# EAGLE design EDMCB (EAGLE 6.6.0)
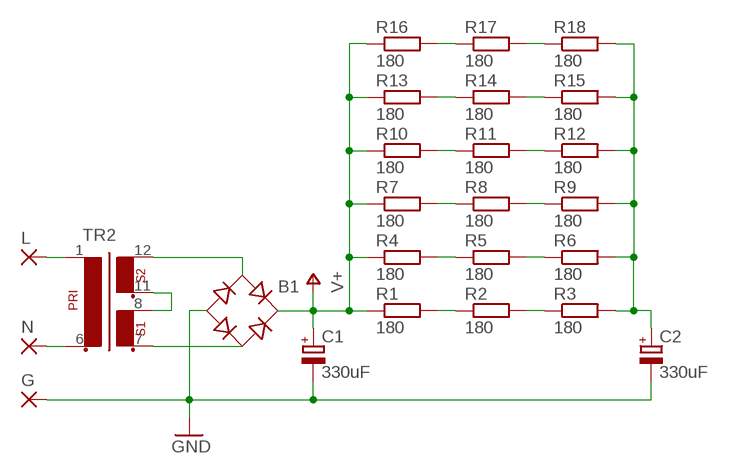
[diagram p0: schematic, sheet 1]

## Parts
B1  RECTIFIER-FB32  [FB32]
C1  330uF  CPOL-EUSANYO_H  [SANYO-OSCON_H]
C2  330uF  CPOL-EUSANYO_H  [SANYO-OSCON_H]
G  WIREPAD4,16O1,6  [4,16O1,6]
L  WIREPAD4,16O1,6  [4,16O1,6]
N  WIREPAD4,16O1,6  [4,16O1,6]
R1  180  R-EU_VTA52  [VTA52]
R2  180  R-EU_VTA52  [VTA52]
R3  180  R-EU_VTA52  [VTA52]
R4  180  R-EU_VTA52  [VTA52]
R5  180  R-EU_VTA52  [VTA52]
R6  180  R-EU_VTA52  [VTA52]
R7  180  R-EU_VTA52  [VTA52]
R8  180  R-EU_VTA52  [VTA52]
R9  180  R-EU_VTA52  [VTA52]
R10  180  R-EU_VTA52  [VTA52]
R11  180  R-EU_VTA52  [VTA52]
R12  180  R-EU_VTA52  [VTA52]
R13  180  R-EU_VTA52  [VTA52]
R14  180  R-EU_VTA52  [VTA52]
R15  180  R-EU_VTA52  [VTA52]
R16  180  R-EU_VTA52  [VTA52]
R17  180  R-EU_VTA52  [VTA52]
R18  180  R-EU_VTA52  [VTA52]
TR2  EI48-2  [EI48-2]

## Nets
GND: B1.- C1.- C2.- G.1(P)
N$1: C2.+ R3.2 R6.2 R9.2 R12.2 R15.2 R18.2
N$2: R1.2 R2.1
N$3: R2.2 R3.1
N$4: N.1(P) TR2.6
N$5: L.1(P) TR2.1
N$6: B1.AC1 TR2.12
N$7: R4.2 R5.1
N$8: R5.2 R6.1
N$9: TR2.8 TR2.11
N$10: B1.AC2 TR2.7
N$11: R7.2 R8.1
N$12: R8.2 R9.1
N$13: R10.2 R11.1
N$14: R11.2 R12.1
N$15: R13.2 R14.1
N$16: R14.2 R15.1
N$17: R16.2 R17.1
N$18: R17.2 R18.1
V+: B1.+ C1.+ R1.1 R4.1 R7.1 R10.1 R13.1 R16.1

## Library data of the parts
B1 = rectifier:RECTIFIER-: Rectifier
C1 C2 = rcl:CPOL-EU: POLARIZED CAPACITOR, European symbol
G L N = wirepad:WIREPAD: Wire PAD connect wire on PCB
R1-R18 = rcl:R-EU_: RESISTOR, European symbol
TR2 = trafo:EI48-2: TRANSFORMER 1 primary winding, 2 secondary windings ERA

## Board
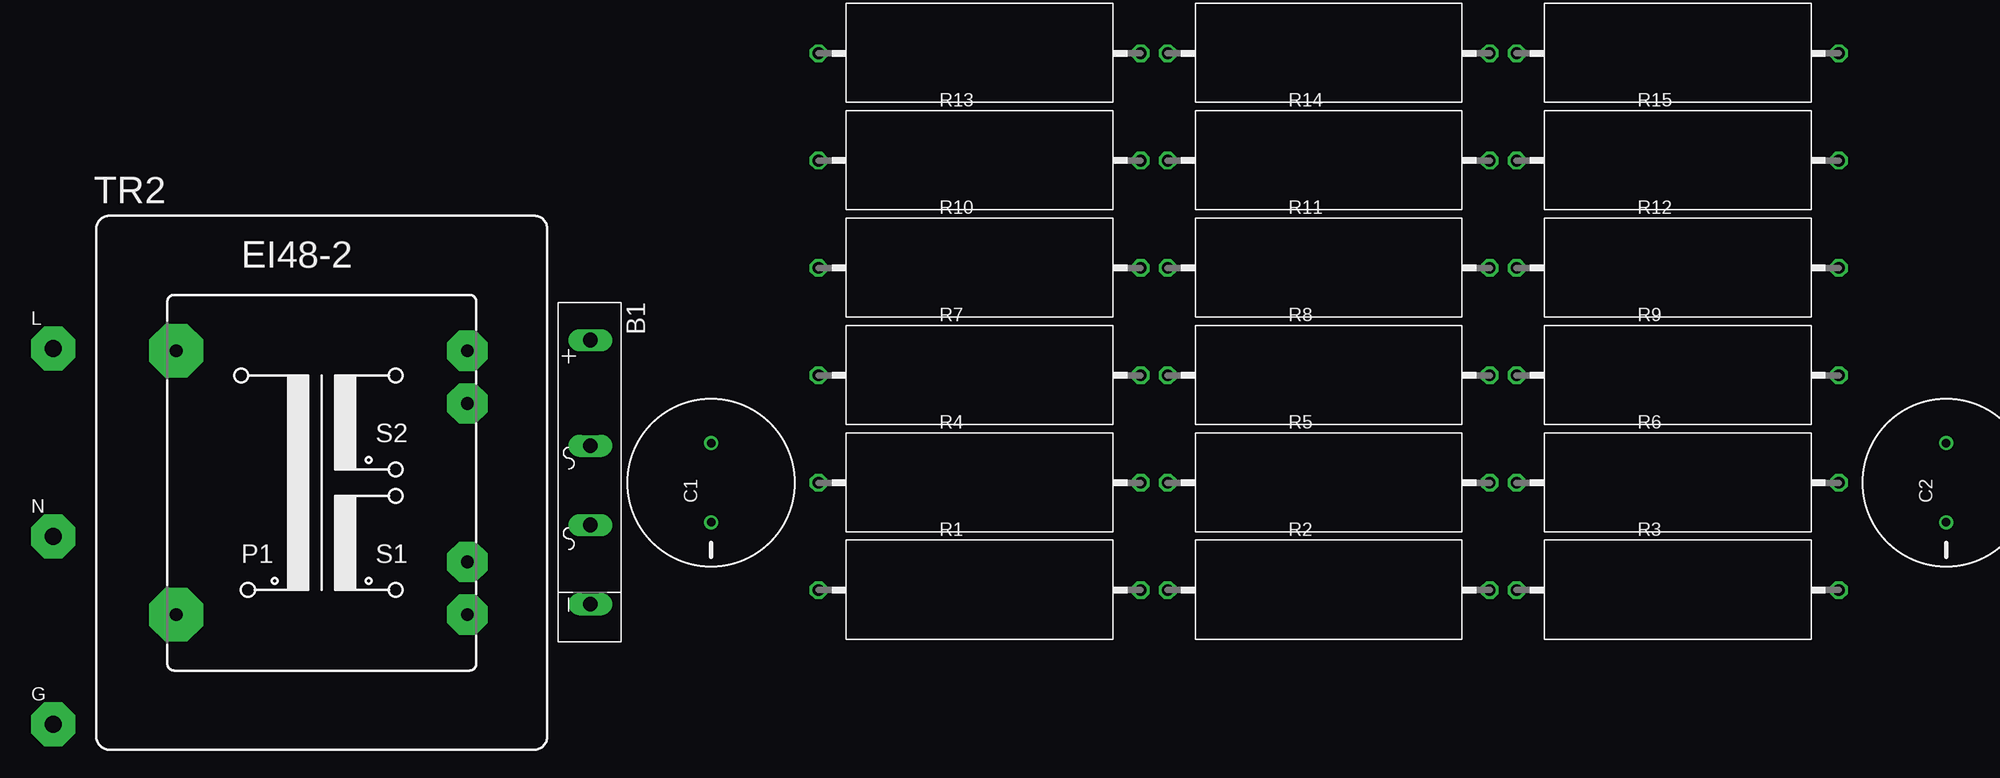
[diagram p1: board, top side]
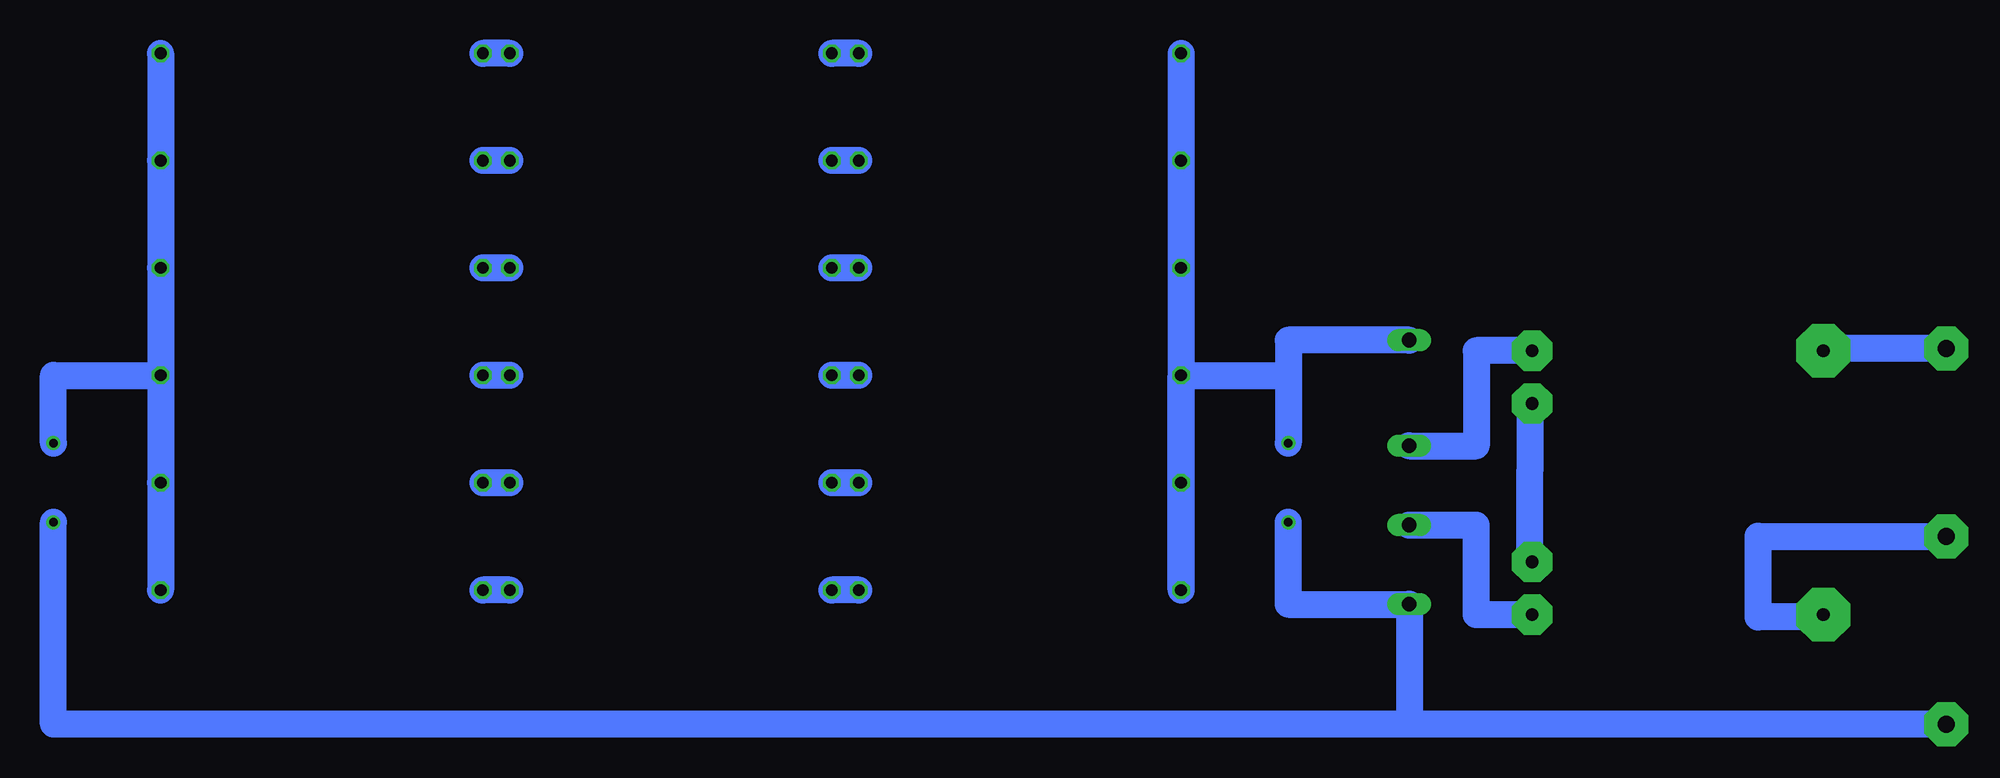
[diagram p2: board, bottom side, seen from below]

No outline drawn. Coordinates in mm, seen from the top.
Copper layers (1*16): Top 0.035mm / dielectric 1.5mm / Bottom 0.035mm
Design rules "default": minimum track width 10mil, minimum drill 24mil, track to track 8mil, track to pad 8mil, pad to pad 8mil, via to via 8mil, smd to smd 8mil, copper to edge 40mil, drill to drill 8mil, minimum pad ring 10mil, minimum via ring 8mil, stop-mask expansion 4mil, vias tented up to drill 0mil, thermal gap 10mil

### Footprints (pad centres in the part's own frame; a part is rotated, then mirrored left to right if it is on the bottom)
FB32 = drill 1.397 long: + -13.5,0; - 11.494,0; AC1 -3.492,0; AC2 4.001,0
SANYO-OSCON_H = drill 0.8 pad 1.27: + 3.75,0; - -3.75,0
4,16O1,6 = drill 1.6 pad 4.166 octagon: 1 0,0
VTA52 = drill 1.1 octagon: 1 -15.24,0; 2 15.24,0
EI48-2 = drill 1.194 pad 5.08 octagon: 1 -13.767,12.497; 6 -13.767,-12.497 | drill 1.194 pad 3.81 octagon: 7 13.767,-12.497; 8 13.767,-7.493; 11 13.767,7.493; 12 13.767,12.497

### Placement (x,y rotation side)
B1  64.77,29.21 270 top
C1  76.2,29.21 90 top
C2  193.04,29.21 90 top
G  13.97,6.35 0 top
L  13.97,41.91 0 top
N  13.97,24.13 0 top
R1  101.6,19.05 0 top
R2  134.62,19.05 0 top
R3  167.64,19.05 0 top
R4  101.6,29.21 0 top
R5  134.62,29.21 0 top
R6  167.64,29.21 0 top
R7  101.6,39.37 0 top
R8  134.62,39.37 0 top
R9  167.64,39.37 0 top
R10  101.6,49.53 0 top
R11  134.62,49.53 0 top
R12  167.64,49.53 0 top
R13  101.6,59.69 0 top
R14  134.62,59.69 0 top
R15  167.64,59.69 0 top
R16  101.6,69.85 0 top
R17  134.62,69.85 0 top
R18  167.64,69.85 0 top
TR2  39.37,29.21 0 top

### Tracks (layer width: path | path; a pad name or v marks a point on that pad's centre or on a via)
GND
  Bottom 2.54: C1.- 76.2,17.72 B1.- 64.77,6.35 | G.1 64.77,6.35 | 64.77,6.35 193.04,6.35 C2.-
N$1
  Bottom 2.54: R18.2 R15.2 R12.2 R9.2 | R9.2 R6.2 R3.2 | C2.+ 193.04,39.37 R9.2
N$2
  Bottom 2.54: R1.2 R2.1
N$3
  Bottom 2.54: R2.2 R3.1
N$4
  Bottom 2.54: N.1 31.75,24.13 31.75,16.51 25.4,16.51 25.4,16.71 TR2.6
N$5
  Bottom 2.54: L.1 25.6,41.91 TR2.1
N$6
  Bottom 2.54: TR2.12 58.42,41.71 58.42,32.7 B1.AC1
N$7
  Bottom 2.54: R4.2 R5.1
N$8
  Bottom 2.54: R5.2 R6.1
N$9
  Bottom 2.54: TR2.11 53.34,36.7 | 53.34,36.7 53.34,36.83 | 53.34,36.7 53.34,31.75 53.34,30.48 53.34,21.72 | TR2.8 53.34,21.72 | 53.34,21.72 53.34,21.59
N$10
  Bottom 2.54: TR2.7 58.42,16.71 58.42,25.21 B1.AC2
N$11
  Bottom 2.54: R7.2 R8.1
N$12
  Bottom 2.54: R8.2 R9.1
N$13
  Bottom 2.54: R10.2 R11.1
N$14
  Bottom 2.54: R11.2 R12.1
N$15
  Bottom 2.54: R13.2 R14.1
N$16
  Bottom 2.54: R14.2 R15.1
N$17
  Bottom 2.54: R16.2 R17.1
N$18
  Bottom 2.54: R17.2 R18.1
V+
  Bottom 2.54: R16.1 R13.1 R10.1 R7.1 | R7.1 R4.1 R1.1 R7.1 | B1.+ 76.2,42.71 76.2,39.37 | 76.2,39.37 C1.+ | R7.1 76.2,39.37